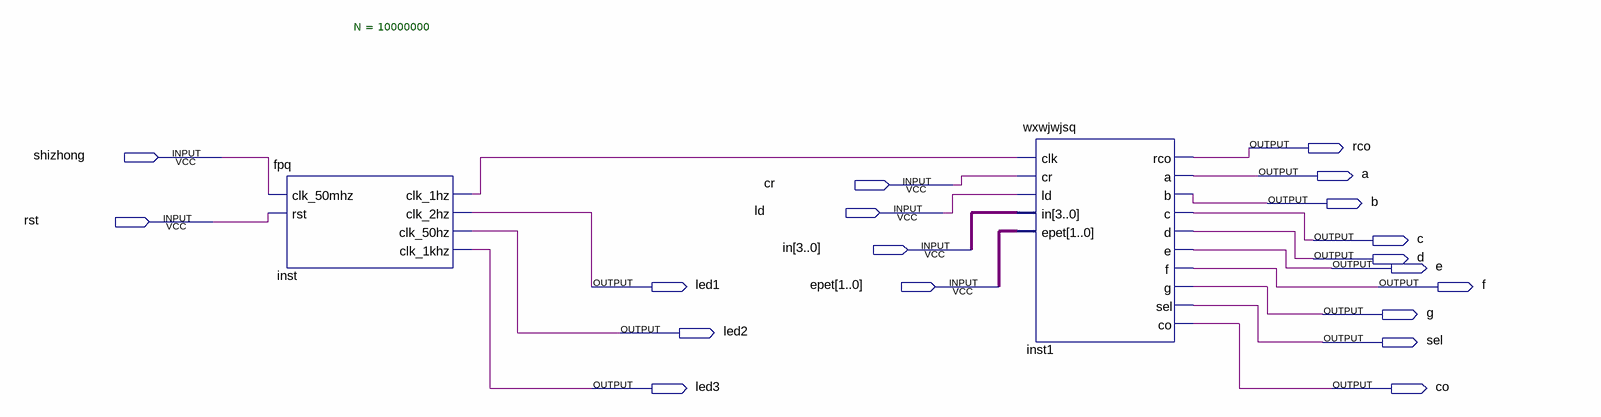
[diagram p0: schematic sheet]
// Quartus schematic Block1.bdf as structural Verilog: 2 symbols, 19 pins
module Block1 (
  input  shizhong,
  input  cr,
  input  ld,
  input  rst,
  input  [3:0] in,
  input  [1:0] epet,
  output rco,
  output a,
  output b,
  output c,
  output d,
  output e,
  output led1,
  output f,
  output g,
  output led2,
  output sel,
  output led3,
  output co
);

  wire inst_clk_1hz;

  fpq #(.N(10000000)) inst (
    .clk_50mhz(shizhong), .rst(rst), .clk_1hz(inst_clk_1hz), .clk_2hz(led1), .clk_50hz(led2), .clk_1khz(led3));
  wxwjwjsq inst1 (
    .clk(inst_clk_1hz), .cr(cr), .ld(ld), .in(in), .epet(epet), .rco(rco), .a(a), .b(b), .c(c), .d(d), .e(e),
    .f(f), .g(g), .sel(sel), .co(co));
endmodule
